# EAGLE design leddriverv4 (EAGLE 9.4.2)
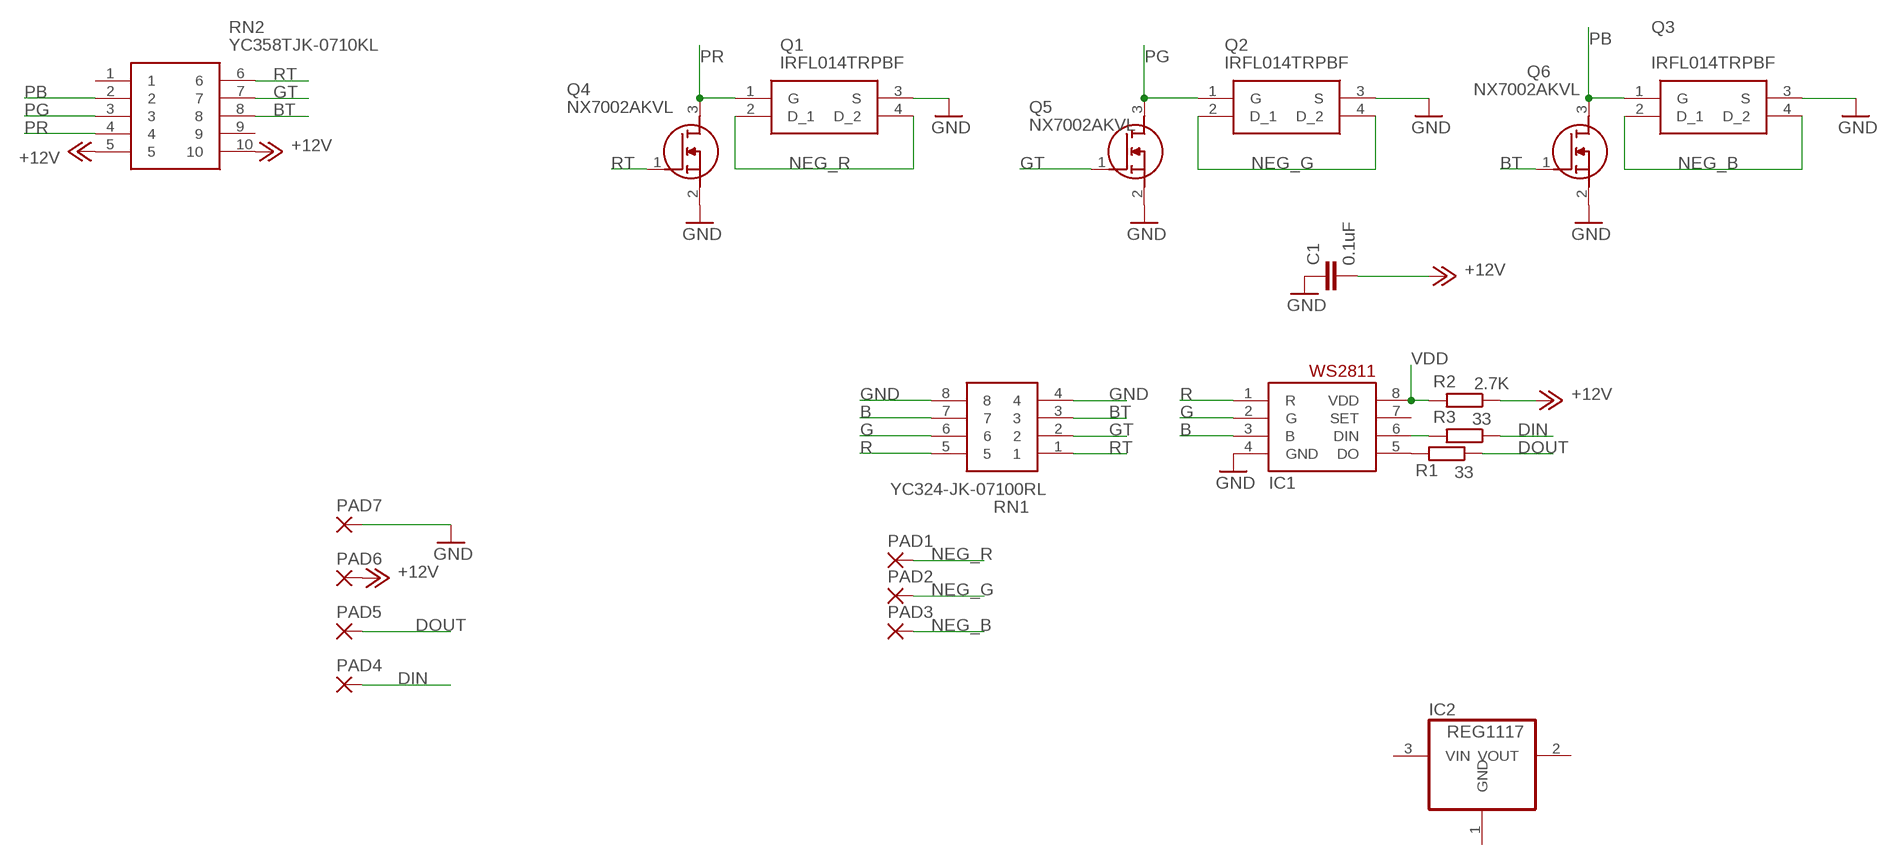
[diagram p0: schematic, sheet 1]

## Parts
C1  0.1uF  C-EUC1206  [C1206]
IC1  WS2811-SOP8  [SO08-SKINNYPADS]
IC2  REG1117  [SOT223]
PAD1  3,81/1,4  [3,81/1,4]
PAD2  3,81/1,4  [3,81/1,4]
PAD3  3,81/1,4  [3,81/1,4]
PAD4  3,81/1,4  [3,81/1,4]
PAD5  3,81/1,4  [3,81/1,4]
PAD6  3,81/1,4  [3,81/1,4]
PAD7  3,81/1,4  [3,81/1,4]
Q1  IRFL014TRPBF  [SOT230P700X180-4N]
Q2  IRFL014TRPBF  [SOT230P700X180-4N]
Q3  IRFL014TRPBF  [SOT230P700X180-4N]
Q4  NX7002AKVL  [SOT95P230X110-3N]
Q5  NX7002AKVL  [SOT95P230X110-3N]
Q6  NX7002AKVL  [SOT95P230X110-3N]
R1  33  R-EU_R1206  [R1206]
R2  2.7K  R-EU_R1206  [R1206]
R3  33  R-EU_R1206  [R1206]
RN1  YC324-JK-07100RL  [YC324JK07100RL]
RN2  YC358TJK-0710KL  [YC358T]

## Nets
+12V: C1.2 PAD6.1(P) R2.1 RN2.5 RN2.10
B: IC1.3(B) RN1.7
BT: Q6.1(G) RN1.3 RN2.8
DIN: PAD4.1(P) R3.1
DOUT: PAD5.1(P) R1.1
G: IC1.2(G) RN1.6
GND: C1.1 IC1.4(GND) PAD7.1(P) Q1.3(S) Q2.3(S) Q3.3(S) Q4.2(S) Q5.2(S) Q6.2(S) RN1.4 RN1.8
GT: Q5.1(G) RN1.2 RN2.7
N$1: IC1.6(DIN) R3.2
N$2: IC1.5(DO) R1.2
NEG_B: PAD3.1(P) Q3.2(D_1) Q3.4(D_2)
NEG_G: PAD2.1(P) Q2.2(D_1) Q2.4(D_2)
NEG_R: PAD1.1(P) Q1.2(D_1) Q1.4(D_2)
PB: Q3.1(G) Q6.3(D) RN2.2
PG: Q2.1(G) Q5.3(D) RN2.3
PR: Q1.1(G) Q4.3(D) RN2.4
R: IC1.1(R) RN1.5
RT: Q4.1(G) RN1.1 RN2.6
VDD: IC1.8(VDD) R2.2
Unconnected: IC1.7(SET) IC2.2(VOUT) IC2.3(VIN) RN2.1 RN2.9

## Power pins joined to a net without a drawn wire
GND: IC2.1(GND)

## Library data of the parts
C1 = rcl:C-EU: CAPACITOR, European symbol; SPICEPREFIX: C
IC1 = adafruit_wsled:WS2811
IC2 = burr-brown:REG1117: 800mA and 1A Low Dropout (LDO) Positive Regulator 1.8V, 2.5V, 2.85V, 3.3V, 5V, and Adj; MPN: REG1117; OC_FARNELL: 1097566; OC_NEWARK: 14P6981
PAD1-PAD7 = wirepad:3,81/1,4: THROUGH-HOLE PAD
Q1-Q3 = SamacSys_Parts:IRFL014TRPBF: Vishay IRFL014TRPBF N-channel MOSFET Transistor, 2.7 A, 60 V, 3-Pin SOT-223 Source: Datasheet <https://componentsearchengine.com/Datasheets/1/IRFL014TRPBF.pdf>; DESCRIPTION: Vishay IRFL014TRPBF N-channel MOSFET Transistor, 2.7 A, 60 V, 3-Pin SOT-223; HEIGHT: 1.8mm; MANUFACTURER_NAME: Vishay; MANUFACTURER_PART_NUMBER: IRFL014TRPBF; MOUSER_PART_NUMBER: 844-IRFL014TRPBF; MOUSER_PRICE-STOCK: https://www.mouser.com/Search/Refine.aspx?Keyword=844-IRFL014TRPBF
Q4-Q6 = SamacSys_Parts:NX7002AKVL: Trans MOSFET N-CH 60V 0.19A 3-Pin TO-236AB Source: Datasheet <https://componentsearchengine.com/Datasheets/1/NX7002AKVL.pdf>; DESCRIPTION: Trans MOSFET N-CH 60V 0.19A 3-Pin TO-236AB; HEIGHT: 1.1mm; MANUFACTURER_NAME: Nexperia; MANUFACTURER_PART_NUMBER: NX7002AKVL; MOUSER_PART_NUMBER: 771-NX7002AKVL; MOUSER_PRICE-STOCK: https://www.mouser.com/Search/Refine.aspx?Keyword=771-NX7002AKVL
R1-R3 = rcl:R-EU_: RESISTOR, European symbol; SPICEPREFIX: R
RN1 = SamacSys_Parts:YC324-JK-07100RL: Resistor Networks & Arrays Source: Datasheet <https://componentsearchengine.com/Datasheets/1/YC324-JK-07100RL.pdf>; DESCRIPTION: Resistor Networks & Arrays; HEIGHT: 0.6mm; MANUFACTURER_NAME: YAGEO (PHYCOMP); MANUFACTURER_PART_NUMBER: YC324-JK-07100RL; MOUSER_PART_NUMBER: 603-YC324-JK-07100RL; MOUSER_PRICE-STOCK: https://www.mouser.com/Search/Refine.aspx?Keyword=603-YC324-JK-07100RL
RN2 = SamacSys_Parts:YC358TJK-0710KL: Resistor Networks & Arrays 10K 5% CONVEX SQUARE 8X1225 Source: Datasheet <https://componentsearchengine.com/Datasheets/1/YC358TJK-0710KL.pdf>; DESCRIPTION: Resistor Networks & Arrays 10K 5% CONVEX SQUARE 8X1225; HEIGHT: mm; MANUFACTURER_NAME: YAGEO (PHYCOMP); MANUFACTURER_PART_NUMBER: YC358TJK-0710KL; MOUSER_PART_NUMBER: 603-YC358TJK-0710KL; MOUSER_PRICE-STOCK: https://www.mouser.com/Search/Refine.aspx?Keyword=603-YC358TJK-0710KL

## Board
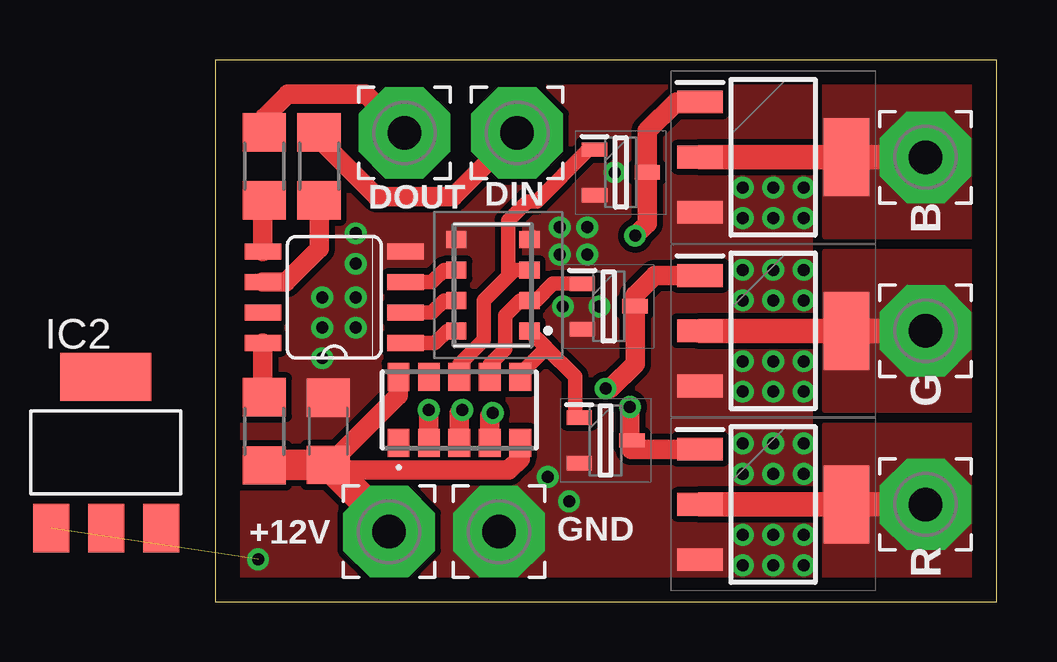
[diagram p1: board, top side]
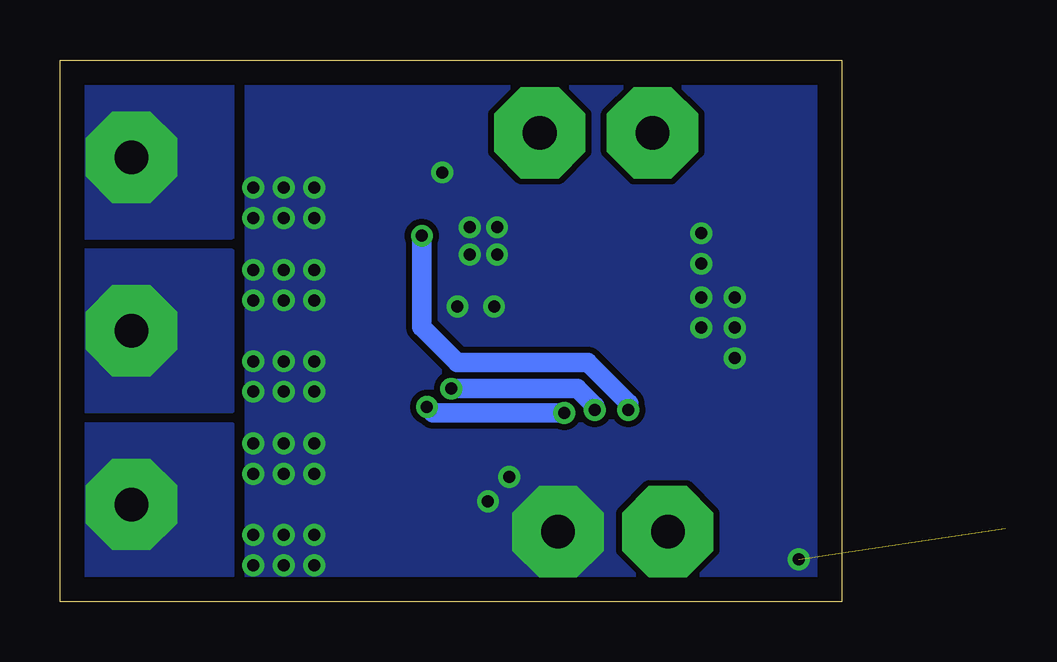
[diagram p2: board, bottom side, seen from below]

Size 32.56 x 22.6 mm. Coordinates in mm from the lower left corner, seen from the top.
Outline: 0,0 32.56,0 32.56,22.6 0,22.6 0,0
Copper layers (1*16): Top 0.035mm / dielectric 1.5mm / Bottom 0.035mm
Design rules "default *": minimum track width 6mil, minimum drill 0.35mm, track to track 6mil, track to pad 6mil, pad to pad 6mil, via to via 6mil, smd to smd 6mil, copper to edge 40mil, drill to drill 6mil, minimum pad ring 10mil, minimum via ring 8mil, stop-mask expansion 4mil, vias tented up to drill 100mil, thermal gap 10mil

### Footprints (pad centres in the part's own frame; a part is rotated, then mirrored left to right if it is on the bottom)
C1206 = smd 1.6 x 1.8: 1 -1.4,0; 2 1.4,0
SO08-SKINNYPADS = smd 0.66 x 1.524: 1 -1.905,-2.973; 2 -0.635,-2.973; 3 0.635,-2.973; 4 1.905,-2.973; 5 1.905,2.973; 6 0.635,2.973; 7 -0.635,2.973; 8 -1.905,2.973
SOT223 = smd 1.499 x 2.007: 1 -2.261,-3.15; 2 0.025,-3.15; 3 2.311,-3.15 | smd 3.81 x 2.007: 4 0,3.15
3,81/1,4 = drill 1.397 pad 3.81 octagon: 1 0,0
SOT230P700X180-4N = smd 1.9 x 0.95: 1 -3.05,2.3; 2 -3.05,0; 3 -3.05,-2.3 | smd 1.9 x 3.25: 4 3.05,0
SOT95P230X110-3N = smd 1.05 x 0.6: 1 -1.1,0.95; 2 -1.1,-0.95; 3 1.1,0
R1206 = smd 1.6 x 1.803: 1 -1.422,0; 2 1.422,0
YC324JK07100RL = smd 0.71 x 0.85: 1 -1.905,-1.525; 2 -0.635,-1.525; 3 0.635,-1.525; 4 1.905,-1.525; 5 -1.905,1.525; 6 -0.635,1.525; 7 0.635,1.525; 8 1.905,1.525
YC358T = smd 0.9 x 1.15: 1 -2.54,-1.375; 2 -1.27,-1.375; 3 0,-1.375; 4 1.27,-1.375; 5 2.54,-1.375; 6 2.54,1.375; 7 1.27,1.375; 8 0,1.375; 9 -1.27,1.375; 10 -2.54,1.375

### Placement (x,y rotation side)
C1  4.7,7.11 270 top
IC1  4.95,12.7 90 top
IC2  -4.57,6.22 0 top
PAD1  29.59,4.06 0 top
PAD2  29.59,11.3 0 top
PAD3  29.59,18.54 0 top
PAD4  12.57,19.56 0 top
PAD5  7.87,19.56 0 top
PAD6  7.24,2.92 0 top
PAD7  11.81,2.92 0 top
Q1  23.24,4.06 0 top
Q2  23.24,11.3 0 top
Q3  23.24,18.54 0 top
Q4  16.26,6.73 0 top
Q5  16.38,12.32 0 top
Q6  16.89,17.91 0 top
R1  2.03,18.16 270 top
R2  2.03,7.11 90 top
R3  4.32,18.16 270 top
RN1  11.56,13.21 90 top
RN2  10.16,8 0 top

### Tracks (layer width: path | path; a pad name or v marks a point on that pad's centre or on a via)
+12V
  Top 0.813: RN2.10 7.62,8.6 4.73,5.71 | RN2.5 12.7,5.97 12.22,5.49 4.95,5.49 4.73,5.71 | 4.73,5.71 C1.2
  Top 1.27: R2.1 2.05,5.71 C1.2 7.24,3.17 PAD6.1
B
  Top 0.61: RN1.7 9.52,13.84 9.02,13.33 IC1.3
BT
  Top 0.61: 12.19,13.59 12.45,13.84 RN1.3 | Q6.1 15.54,18.86 13.38,16.7 13,16.7 12.19,15.89 12.19,13.59 | 12.19,13.59 11.18,12.57 11.18,10.92 10.16,9.91 RN2.8
DIN
  Top 0.813: PAD4.1 9.91,16.89 6.73,16.89 4.32,19.3 R3.1
DOUT
  Top 0.813: R1.1 2.03,20.19 3.01,21.17 6.26,21.17 PAD5.1
G
  Top 0.61: RN1.6 9.52,12.57 9.02,12.06 IC1.2
GND  (via drill 0.5)  (1 unrouted)
  Top 0.61: RN1.4 13.21,15.24
  other vias: 4.44,11.43 4.44,10.16 21.97,17.27 23.24,17.27 4.44,12.7 16,12.32 14.35,15.62 14.73,4.19 16.64,17.91 1.78,1.78 5.84,15.37 24.51,17.27 21.97,16 23.24,16 24.51,16 21.97,6.6 23.24,6.6 24.51,6.6 21.97,5.33 23.24,5.33 24.51,5.33 21.97,10.03 23.24,10.03 24.51,10.03 21.97,8.76 23.24,8.76 24.51,8.76 21.97,13.84 23.24,13.84 24.51,13.84 21.97,12.57 23.24,12.57 24.51,12.57 21.97,2.79 23.24,2.79 24.51,2.79 21.97,1.52 23.24,1.52 24.51,1.52 13.84,5.21 14.35,14.48 15.49,14.48 15.49,15.62 14.48,12.32 5.84,11.43 5.84,12.7 5.84,14.1
  pour Top (isolate 0.254, no thermals): 0.13,22.48 24.77,22.48 24.77,0.25 0.13,0.25
  pour Bottom (isolate 0.254, no thermals): 0.13,22.48 24.77,22.48 24.77,0 0.13,0
GT
  Top 0.61: Q5.1 14.06,13.27 13.37,12.57 RN1.2 12.7,12.57 12.06,11.94 12.06,10.54 11.43,9.91 RN2.7
N$1
  Top 0.813: IC1.6 2.92,13.33 4.32,14.73 R3.2
N$2
  Top 0.813: IC1.5 1.98,16.69 R1.2
NEG_B
  Top 1.016: Q3.2 Q3.4 PAD3.1
  pour Top (isolate 0.254, no thermals): 25.4,22.48 32.38,22.48 32.38,15.24 25.4,15.24
  pour Bottom (isolate 0.254, no thermals): 25.4,21.46 32.38,21.46 32.38,15.24 25.4,15.24
NEG_G
  Top 1.016: Q2.2 Q2.4 PAD2.1
  pour Top (isolate 0.254, no thermals): 25.4,14.61 32.38,14.61 32.38,8 25.4,8
  pour Bottom (isolate 0.254, no thermals): 25.4,14.61 32.38,14.61 32.38,8 25.4,8
NEG_R
  Top 1.016: Q1.2 Q1.4 PAD1.1
  pour Top (isolate 0.254, no thermals): 25.4,7.37 32.38,7.37 32.38,0.25 25.4,0.25
  pour Bottom (isolate 0.254, no thermals): 25.4,7.37 32.38,7.37 32.38,1.14 25.4,1.14
PB  (via drill 0.5)
  Top 0.813: Q3.1 19.19,20.84 17.99,19.64 Q6.3 17.99,15.77 v17.48,15.26 | RN2.2 v8.89,8
  Bottom 0.813: v8.89,8 8.87,8.02 8.87,8.27 10.58,9.98 16,9.98 17.48,11.46 v17.48,15.26
PG  (via drill 0.5)
  Top 0.813: Q2.1 18.3,13.6 17.48,12.78 Q5.3 17.48,9.93 16.44,8.89 v16.26,8.89 | v10.29,8 10.16,7.87 RN2.3
  Bottom 0.813: v10.29,8 10.29,8.16 11.02,8.89 v16.26,8.89
PR  (via drill 0.5)
  Top 0.254: Q4.3 17.36,6.39 17.33,6.36
  Top 0.813: Q1.1 17.33,6.36 | RN2.4 11.43,7.75 v11.56,7.87 | v17.27,8.13 17.27,6.81 Q4.3
  Bottom 0.813: v17.27,8.13 17.02,7.87 v11.56,7.87
R
  Top 0.61: RN1.5 9.65,11.3 9.14,10.79 IC1.1
RT
  Top 0.61: Q4.1 14.99,7.85 14.99,9.4 13.79,10.59 | RN1.1 13.78,10.61 13.79,10.59 | 13.79,10.59 12.7,9.5 RN2.6
VDD
  Top 0.813: IC1.8 1.98,8.59 R2.2

### Text on the board
tNames: DIN | DOUT | B | G | +12V | GND | R